# Altium schematic sheet FE_Channel.SchDoc: ThunderScope 1000E
size A3; DrawnBy: Aleksa Bjelogrlic; Revision: 1
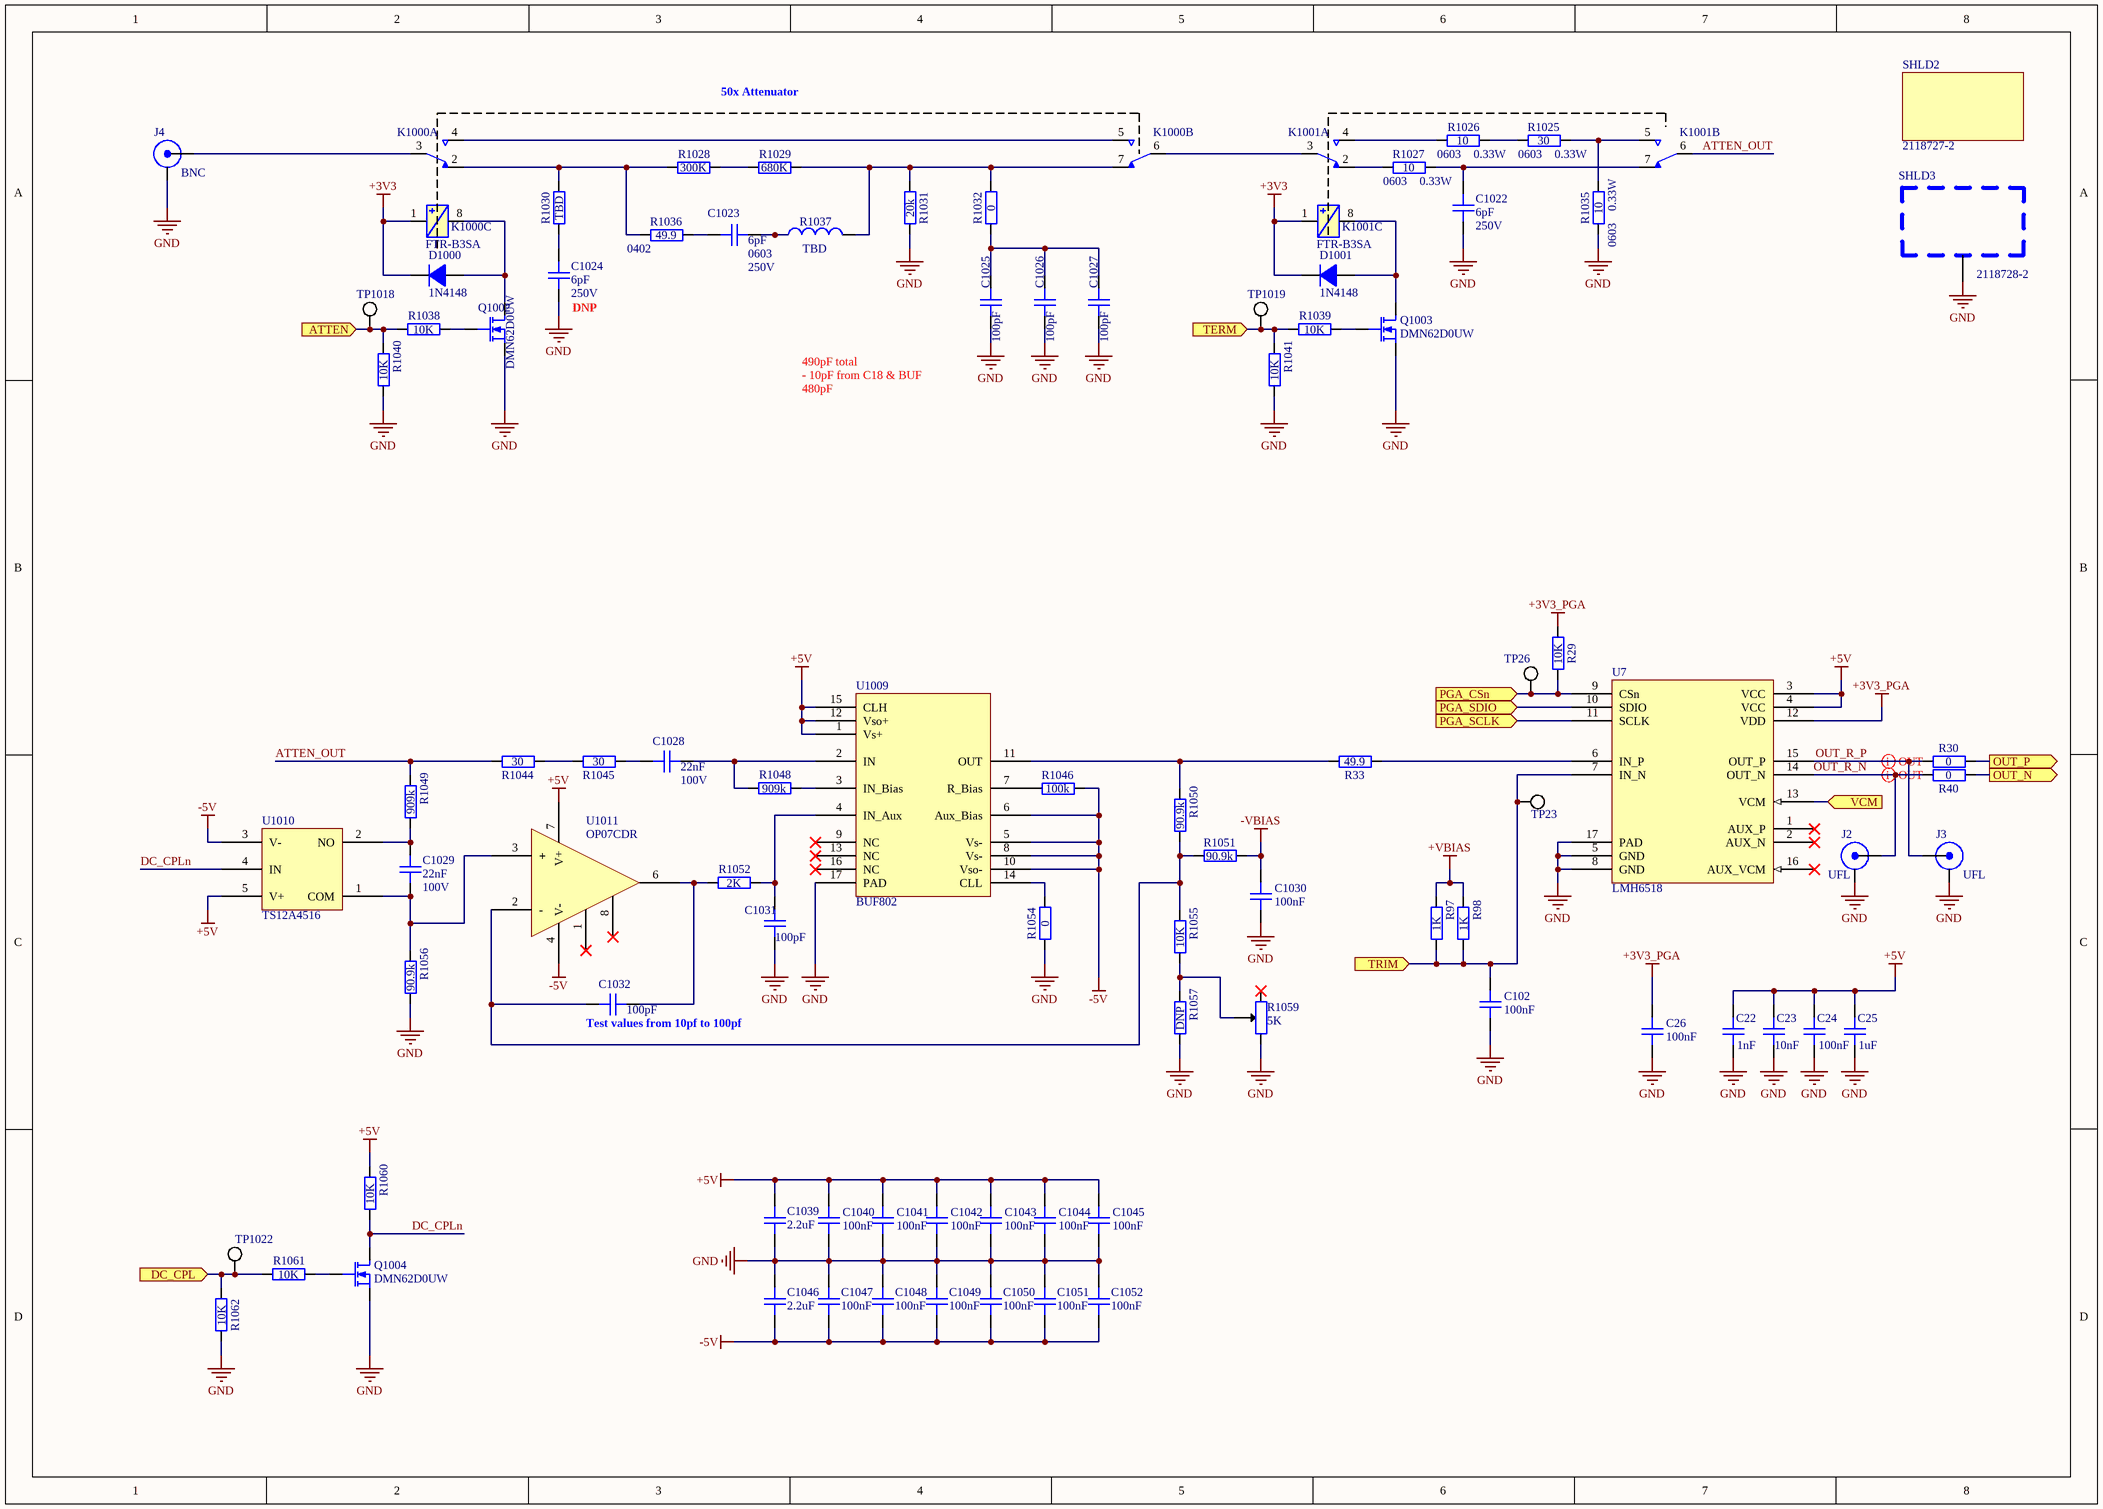
[diagram p0: FE_Channel.SchDoc]

## Parts
C22  1nF  [GEN_C_0402]
C23  10nF  [GEN_C_0402]
C24  100nF  [GEN_C_0402]
C25  1uF  [GEN_C_0402]
C26  100nF  [GEN_C_0402]
C102  100nF  [GEN_C_0402]
C1022  6pF  Voltage Rating: 250V  [GEN_C_0603]
C1023  6pF  Package: 0603  Voltage Rating: 250V  [GEN_C_0603]
C1024  6pF  Voltage Rating: 250V  [GEN_C_0603]
C1025  100pF  [GEN_C_0402]
C1026  100pF  [GEN_C_0402]
C1027  100pF  [GEN_C_0402]
C1028  22nF  Voltage Rating: 100V  [GEN_C_0603]
C1029  22nF  Voltage Rating: 100V  [GEN_C_0603]
C1030  100nF  [GEN_C_0402]
C1031  100pF  [GEN_C_0402]
C1032  100pF  [GEN_C_0402]
C1039  2.2uF  [GEN_C_0402]
C1040  100nF  [GEN_C_0402]
C1041  100nF  [GEN_C_0402]
C1042  100nF  [GEN_C_0402]
C1043  100nF  [GEN_C_0402]
C1044  100nF  [GEN_C_0402]
C1045  100nF  [GEN_C_0402]
C1046  2.2uF  [GEN_C_0402]
C1047  100nF  [GEN_C_0402]
C1048  100nF  [GEN_C_0402]
C1049  100nF  [GEN_C_0402]
C1050  100nF  [GEN_C_0402]
C1051  100nF  [GEN_C_0402]
C1052  100nF  [GEN_C_0402]
D1000  1N4148  [GEN_SOD_323]
D1001  1N4148  [GEN_SOD_323]
J2  UFL  [TE_2334884-1]
J3  UFL  [TE_2334884-1]
J4  BNC  [MOL_0731000105]
K1000  FTR-B3SA  [FUJ_FTR-B3SA]  (value not drawn)  (parts A,B,C of 3)
K1001  FTR-B3SA  [FUJ_FTR-B3SA]  (value not drawn)  (parts A,B,C of 3)
Q1002  DMN62D0UW  [GEN_SOT_323]
Q1003  DMN62D0UW  [GEN_SOT_323]
Q1004  DMN62D0UW  [GEN_SOT_323]
R29  10K  [GEN_R_0402]
R30  0  [GEN_R_0402]
R33  49.9  [GEN_R_0402]
R40  0  [GEN_R_0402]
R97  1K  [GEN_R_0402]
R98  1K  [GEN_R_0402]
R1025  30  Power Rating: 0.33W  Package: 0603  [GEN_R_0603]
R1026  10  Package: 0603  Power Rating: 0.33W  [GEN_R_0603]
R1027  10  Package: 0603  Power Rating: 0.33W  [GEN_R_0603]
R1028  300K  [GEN_R_0402]
R1029  680K  [GEN_R_0402]
R1030  TBD  [GEN_R_0402]  (no BOM)
R1031  20k  [GEN_R_0402]
R1032  0  [GEN_R_0402]
R1035  10  Power Rating: 0.33W  Package: 0603  [GEN_R_0603]
R1036  49.9  Package: 0402  [GEN_R_0402]
R1037  TBD  [GEN_L_0402]
R1038  10K  [GEN_R_0402]
R1039  10K  [GEN_R_0402]
R1040  10K  [GEN_R_0402]
R1041  10K  [GEN_R_0402]
R1044  30  [GEN_R_0603]
R1045  30  [GEN_R_0603]
R1046  100k  [GEN_R_0402]
R1048  909k  [GEN_R_0402]
R1049  909k  [GEN_R_0402]
R1050  90.9k  [GEN_R_0402]
R1051  90.9k  [GEN_R_0402]
R1052  2K  [GEN_R_0402]
R1054  0  [GEN_R_0402]
R1055  10K  [GEN_R_0402]
R1056  90.9k  [GEN_R_0402]
R1057  DNP  [GEN_R_0402]  (no BOM)
R1059  5K  [BOU_3mm_POT]
R1060  10K  [GEN_R_0402]
R1061  10K  [GEN_R_0402]
R1062  10K  [GEN_R_0402]
SHLD2  2118727-2  (mechanical)
SHLD3  2118728-2  [TE_2118728-2]
TP23  PCB  [GEN_TP_PCB]  (value not drawn)  (no BOM)
TP26  PCB  [GEN_TP_PCB]  (value not drawn)  (no BOM)
TP1018  PCB  [GEN_TP_PCB]  (value not drawn)  (no BOM)
TP1019  PCB  [GEN_TP_PCB]  (value not drawn)  (no BOM)
TP1022  PCB  [GEN_TP_PCB]  (value not drawn)  (no BOM)
U7  LMH6518  [TI_WQFN_RGH0016A]
U1009  BUF802  [TI_VQFN_RGT0016C]
U1010  TS12A4516  [GEN_SOT23_5_950_2900X1600X1450]
U1011  OP07CDR  [TI_SOIC8_D0008A]

## Ports
ATTEN (in), DC_CPL (in), OUT_N (out), OUT_P (out), PGA_CSn (in), PGA_SCLK (in), PGA_SDIO (in), TERM (in), TRIM (in), VCM (in)

## Nets
+3V3: D1000.1(K) D1001.1(K) K1000.1 K1001.1
+3V3_PGA: C26.2 R29.2 U7.12(VDD)
+5V: C22.2 C23.2 C24.2 C25.2 C1039.2 C1040.1 C1041.1 C1042.1 C1043.2 C1044.2 C1045.2 R1060.2 U7.3(VCC) U7.4(VCC) U1009.1(Vs+) U1009.12(Vso+) U1009.15(CLH) U1010.5(V+) U1011.7(V+)
+VBIAS: R97.2 R98.1
-5V: C1046.2 C1047.2 C1048.1 C1049.1 C1050.1 C1051.2 C1052.2 R1046.2 U1009.5(Vs-) U1009.6(Aux_Bias) U1009.8(Vs-) U1009.10(Vso-) U1010.3(V-) U1011.4(V-)
-VBIAS: C1030.1 R1051.1
GND: C22.1 C23.1 C24.1 C25.1 C26.1 C102.2 C1022.2 C1024.1 C1025.1 C1026.1 C1027.1 C1030.2 C1031.1 C1039.1 C1040.2 C1041.2 C1042.2 C1043.1 C1044.1 C1045.1 C1046.1 C1047.1 C1048.2 C1049.2 C1050.2 C1051.1 C1052.1 J2.2(SHIELD) J3.2(SHIELD) J4.2(SHIELD) Q1002.3(S) Q1003.3(S) Q1004.3(S) R1031.1 R1035.1 R1040.1 R1041.1 R1054.1 R1056.1 R1057.1 R1059.3 R1062.1 SHLD3.1 U7.5(GND) U7.8(GND) U7.17(PAD) U1009.17(PAD)
ATTEN: R1038.2 R1040.2 TP1018.1 ; port ATTEN
ATTEN_OUT: K1001.6 R1044.1 R1049.2
DC_CPL: R1061.2 R1062.2 TP1022.1 ; port DC_CPL
DC_CPLn: Q1004.1(D) R1060.1 U1010.4(IN)
OUT_N: R40.2 ; port OUT_N
OUT_P: R30.2 ; port OUT_P
OUT_R_N: J2.1(Signal) R40.1 U7.14(OUT_N)
OUT_R_P: J3.1(Signal) R30.1 U7.15(OUT_P)
PGA_CSn: R29.1 TP26.1 U7.9(CSn) ; port PGA_CSn
PGA_SCLK: U7.11(SCLK) ; port PGA_SCLK
PGA_SDIO: U7.10(SDIO) ; port PGA_SDIO
TERM: R1039.2 R1041.2 TP1019.1 ; port TERM
TRIM: C102.1 R97.1 R98.2 TP23.1 U7.7(IN_N) ; port TRIM
VCM: U7.13(VCM) ; port VCM
NetC1022_1: C1022.1 K1001.7 R1027.2
NetC1023_1: C1023.1 R1037.1
NetC1023_2: C1023.2 R1036.2
NetC1024_2: C1024.2 R1030.1
NetC1025_2: C1025.2 C1026.2 C1027.2 R1032.1
NetC1028_1: C1028.1 R1048.2 U1009.2(IN)
NetC1028_2: C1028.2 R1045.2
NetC1029_1: C1029.1 R1049.1 U1010.2(NO)
NetC1029_2: C1029.2 R1056.2 U1010.1(COM) U1011.3(+)
NetC1031_2: C1031.2 R1052.1 U1009.4(IN_Aux)
NetC1032_1: C1032.1 R1052.2 U1011.6(OUT)
NetC1032_2: C1032.2 R1050.1 R1051.2 R1055.2 U1011.2(-)
NetD1000_2: D1000.2(A) K1000.8 Q1002.1(D)
NetD1001_2: D1001.2(A) K1001.8 Q1003.1(D)
NetJ4_1: J4.1(Signal) K1000.3
NetK1000_2: K1000.2 R1028.1 R1030.2 R1036.1
NetK1000_4: K1000.4 K1000.5
NetK1000_6: K1000.6 K1001.3
NetK1000_7: K1000.7 R1029.2 R1031.2 R1032.2 R1037.2
NetK1001_2: K1001.2 R1027.1
NetK1001_4: K1001.4 R1026.1
NetK1001_5: K1001.5 R1025.2 R1035.2
NetQ1002_2: Q1002.2(G) R1038.1
NetQ1003_2: Q1003.2(G) R1039.1
NetQ1004_2: Q1004.2(G) R1061.1
NetR33_1: R33.1 R1050.2 U1009.11(OUT)
NetR33_2: R33.2 U7.6(IN_P)
NetR1025_1: R1025.1 R1026.2
NetR1028_2: R1028.2 R1029.1
NetR1044_2: R1044.2 R1045.1
NetR1046_1: R1046.1 U1009.7(R_Bias)
NetR1048_1: R1048.1 U1009.3(IN_Bias)
NetR1054_2: R1054.2 U1009.14(CLL)
NetR1055_1: R1055.1 R1057.2 R1059.2

Not connected (* = marked no-connect by the designer): R1059 1*; U7 1(AUX_P)* 2(AUX_N)* 16(AUX_VCM)*; U1009 9(NC)* 13(NC)* 16(NC)*; U1011 1(N1)* 8(N2)*

## Layout directives
differential pair; differential pair class 100Z_Diff_PGA: OUT_R_N, OUT_R_P

## Notes on the sheet
- 50x Attenuator
- (near C1024) DNP
- 490pF total
- - 10pF from C18 & BUF
- 480pF
- (near C1032) Test values from 10pf to 100pf

## Library data of the parts
C22 = CAP 1nF 50V C0G 0402: Voltage Rating: 50V; Package: 0402; Supplier 1: Digi-Key; Supplier Part Number 1: 490-6189-1-ND; Value: 1nF
C23 = CAP 10nF 50V X7R 0402: Voltage Rating: 50V; Package: 0402; Supplier 1: Digi-Key; Supplier Part Number 1: 490-6351-1-ND; Value: 10nF
C24 C26 C102 C1030 C1040-C1045 C1047-C1052 = CAP 100nF 16V X7R 0402: Voltage Rating: 16V; Package: 0402; Supplier 1: Digi-Key; Supplier Part Number 1: 490-4759-1-ND; Value: 100nF
C25 = CAP 1uF 25V X5R 0402: Voltage Rating: 25V; Package: 0402; Supplier 1: Digi-Key; Supplier Part Number 1: 490-10017-1-ND; Value: 1uF
C1022-C1024 = CAP 6pF 250V C0G 0603: Manufacturer: KEMET; Manufacturer Part Number: CBR06C609BAGAC; Value: 6pF; Supplier 1: Digi-Key; Supplier Part Number 1: 399-8734-1-ND
  C1022 C1024: Package: 0603
C1025-C1027 = CAP 100pF 50V C0G 0402: Manufacturer: Murata; Manufacturer Part Number: GCM1555C1H101FA16D; Voltage Rating: 50V; Temperature Coefficient: C0G; Package: 0402; Supplier 1: Digi-Key; Supplier Part Number 1: 490-14349-1-ND; Value: 100pF
C1028 C1029 = CAP 22nF 100V X7R 0603: Package: 0603; Value: 22nF; Supplier 1: Digi-Key; Supplier Part Number 1: 490-4782-1-ND
C1031 C1032 = CAP 100pF 50V C0G 0402: Temperature Coefficient: C0G; Voltage Rating: 50V; Package: 0402; Value: 100pF; Supplier 1: Digi-Key; Supplier Part Number 1: 490-14349-1-ND
C1039 C1046 = CAP 2.2uF 10V X5R 0402: Voltage Rating: 10V; Package: 0402; Supplier 1: Digi-Key; Supplier Part Number 1: 587-3153-1-ND; Value: 2.2uF
D1000 D1001 = DIODE 1N4148: Max Reverse Voltage: 75V; Max Current: 150mA; Supplier 1: Digi-Key; Supplier Part Number 1: 1N4148WS-FDICT-ND
J2 J3 = UFL Jack SMD: Supplier 1: Digi-Key; Supplier Part Number 1: A145155CT-ND
J4 = BNC JACK R/A: Supplier 1: Digi-Key; Supplier Part Number 1: WM5524-ND
K1000 K1001 = RELAY DPDT-NO FTR-B3SA: Supplier 1: Mouser; Supplier Part Number 1: 817-FTR-B3SA003Z
Q1002-Q1004 = NMOS DMN62D0UW: Vdss: 60V; Id: 340mA; Max Power: 320mW; Supplier 1: Digi-Key; Supplier Part Number 1: DMN62D0UW-7DICT-ND
R29 R1038-R1041 R1055 R1061 = RES 10K OHM 1% 1/10W 0402: Tolerance: 1%; Power Rating: 0.1W; Package: 0402; Supplier 1: Digi-Key; Supplier Part Number 1: P10.0KLCT-ND; Value: 10K
R30 R40 R1054 = RES 0 OHM 1/16W 0402: Power Rating: 0.0625W; Package: 0402; Supplier 1: Digi-Key; Supplier Part Number 1: 311-0.0JRCT-ND; Value: 0
R33 R1036 = RES 49.9 OHM 1% 1/10W 0402: Manufacturer: Yageo; Manufacturer Part Number: RC0402FR-0749R9L; Tolerance: 1%; Value: 49.9; Supplier 1: Digi-Key; Supplier Part Number 1: 311-49.9LRCT-ND
  R33: Package: 0402
R97 R98 = RES 1K OHM 1% 1/10W 0402: Tolerance: 1%; Power Rating: 0.1W; Package: 0402; Supplier 1: Digi-Key; Supplier Part Number 1: 311-1.00KLRCT-ND; Value: 1K
R1025 = RES 30 OHM 1% 1/3W 0603: Tolerance: 1%; Value: 30; Supplier 1: Digi-Key; Supplier Part Number 1: 2019-SG73P1JTTD30R0FCT-ND
R1026 R1035 = RES 10 OHM 1% 1/3W 0603: Tolerance: 1%; Value: 10; Supplier 1: Digi-Key; Supplier Part Number 1: 2019-SG73P1JTTD10R0FCT-ND
R1027 = RES 10 OHM 1% 1/3W 0603: Manufacturer: KOA Speer; Manufacturer Part Number: SG73P1JTTD10R0F; Tolerance: 1%; Value: 10; Supplier 1: Digi-Key; Supplier Part Number 1: 2019-SG73P1JTTD10R0FCT-ND
R1028 = RES 300K OHM 1% 1/10W 0402: Manufacturer: Panasonic; Manufacturer Part Number: ERJ-2RKF3003X; Tolerance: 1%; Package: 0402; Supplier 1: Digi-Key; Supplier Part Number 1: P300KLCT-ND; Value: 300K
R1029 = RES 680K OHM 1% 1/16W 0402: Manufacturer: Yageo; Manufacturer Part Number: RC0402FR-07681KL; Tolerance: 1%; Package: 0402; Supplier 1: Digi-Key; Supplier Part Number 1: YAG3211CT-ND; Value: 680K
R1030 = RES TBD 0402: Tolerance: 1%; Value: TBD; Package: 0402
R1031 = RES 20K OHM 1% 1/16W 0402: Manufacturer: Yageo; Manufacturer Part Number: RC0402FR-0720KL; Tolerance: 1%; Package: 0402; Supplier 1: Digi-Key; Supplier Part Number 1: 311-20.0KLRCT-ND; Value: 20k
R1032 = RES 0 OHM 1/16W 0402: Manufacturer: Yageo; Manufacturer Part Number: RC0402JR-070RL; Package: 0402; Supplier 1: Digi-Key; Supplier Part Number 1: 311-0.0JRCT-ND; Value: 0
R1037 = IND TBD 0402: Value: TBD
R1044 R1045 = RES 30 OHM 1% 1/3W 0603: Manufacturer: KOA Speer; Manufacturer Part Number: SG73P1JTTD30R0F; Tolerance: 1%; Package: 0603; Value: 30; Supplier 1: Digi-Key; Supplier Part Number 1: 2019-SG73P1JTTD30R0FCT-ND
R1046 = RES 100K OHM 1% 1/10W 0402: Tolerance: 1%; Power Rating: 0.1W; Package: 0402; Value: 100k; Supplier 1: Digi-Key; Supplier Part Number 1: 311-100KLRCT-ND
R1048 R1049 = RES 909K OHM 1% 1/16W 0402: Tolerance: 1%; Power Rating: 0.0625W; Package: 0402; Supplier 1: Digi-Key; Supplier Part Number 1: YAG2377CT-ND; Value: 909k
R1050 R1051 R1056 = RES 90.9K OHM 1% 1/16W 0402: Tolerance: 1%; Power Rating: 0.0625W; Package: 0402; Supplier 1: Digi-Key; Supplier Part Number 1: 311-90.9KLRCT-ND; Value: 90.9k
R1052 = RES 2K OHM 1% 1/16W 0402: Tolerance: 1%; Power Rating: 0.0625W; Package: 0402; Supplier 1: Digi-Key; Supplier Part Number 1: 311-2KLRCT-ND; Value: 2K
R1057 = RES DNP 0402: Tolerance: 1%; Power Rating: 0.0625W; Package: 0402; Value: DNP
R1059 = TRIMMER 5K OHM 0.1W J LEAD TOP: Tolerance: 1%; Power Rating: 0.1W; Supplier 1: Digi-Key; Supplier Part Number 1: TC33X-502ECT-ND; Value: 5K
R1060 R1062 = RES 10K OHM 1% 1/10W 0402: Manufacturer: Panasonic; Manufacturer Part Number: ERJ-2RKF1002X; Tolerance: 1%; Package: 0402; Supplier 1: Digi-Key; Supplier Part Number 1: P10.0KLCT-ND; Value: 10K
SHLD2 = SHIELD 2118727-2: Supplier 1: Digi-Key; Supplier Part Number 1: A126132-ND
SHLD3 = SHIELD 2118728-2: Supplier 1: Digi-Key; Supplier Part Number 1: A126158CT-ND
TP23 TP26 TP1018 TP1019 TP1022 = TP PCB 1mm
U7 = IC PGA LMH6518: Supplier 1: Digi-Key; Supplier Part Number 1: LMH6518SQE/NOPBCT-ND
U1009 = IC BUFFER AMP BUF802: Supplier 1: Mouser; Supplier Part Number 1: 595-BUF802IRGTR
U1010 = IC SWITCH SPST TS12A4516DBVR: Manufacturer: Texas Instruments; Supplier 1: Digi-Key; Supplier Part Number 1: 296-24269-1-ND; Manufacturer Part Number: TS12A4516DBVR
U1011 = IC OPAMP OP07CDR: Supplier 1: Digi-Key; Supplier Part Number 1: 296-14626-1-ND